# EAGLE design tdo_frontend (EAGLE 9.6.2)
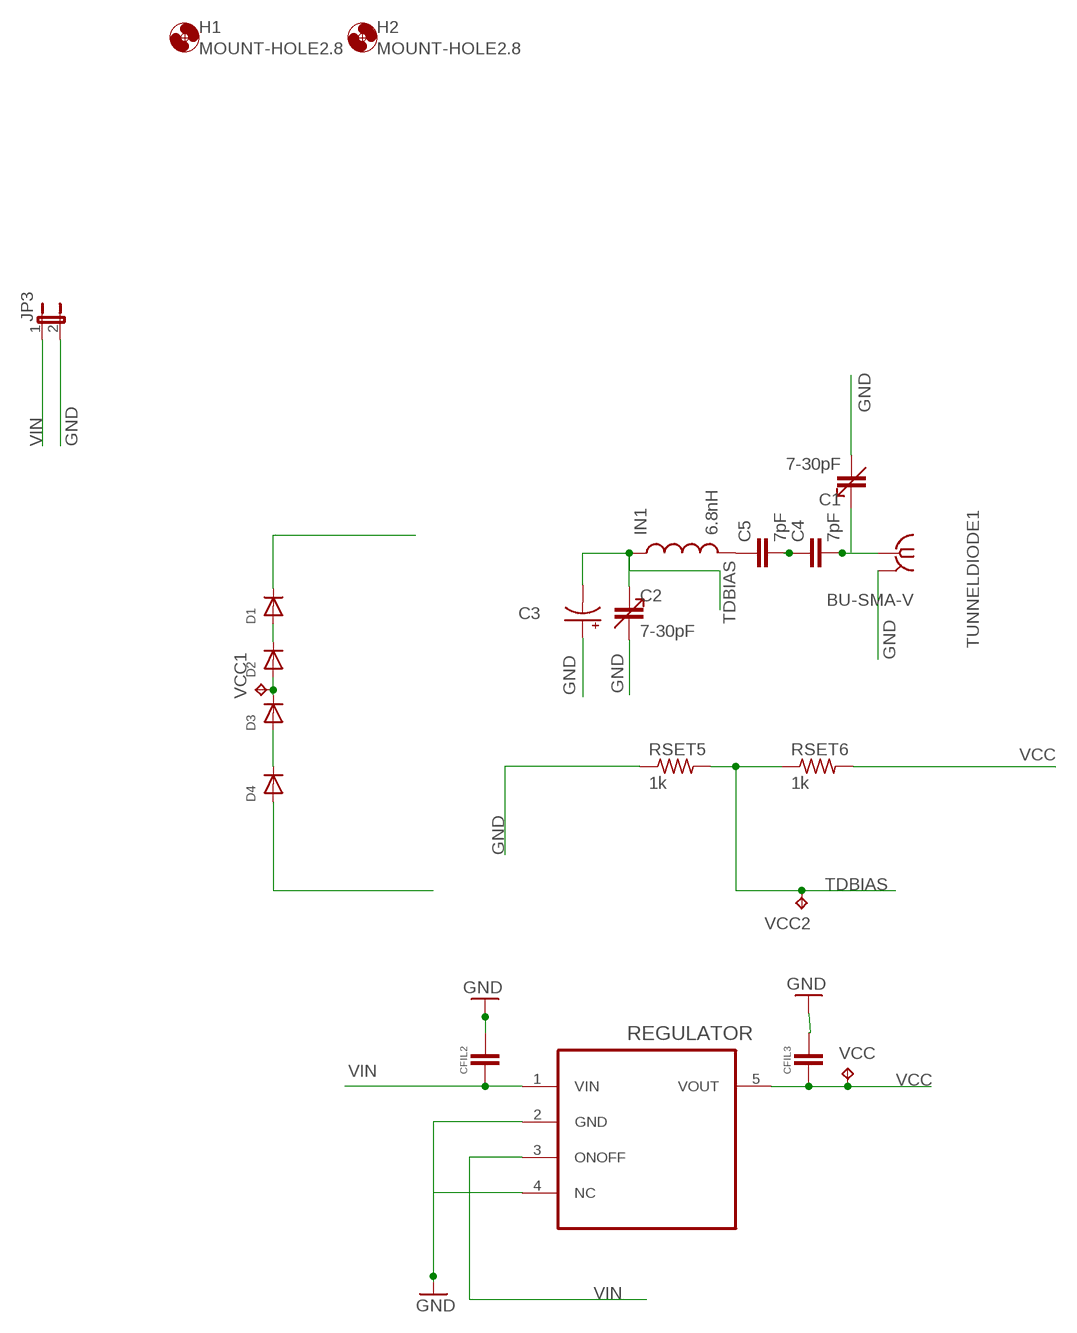
[diagram p0: schematic, sheet 1]

## Parts
C1  7-30pF  CAP_ADJSMD  [CTZ3]
C2  7-30pF  CAP_ADJSMD  [CTZ3]
C3  .22F-SUPERCAP  [DSK-RADIAL-4.8MM]
C4  7pF  CAPACITOR  [C0603]
C5  7pF  CAPACITOR  [C0603]
CFIL2  0805_1  [0805_1PRIMARY]
CFIL3  0805_1  [0805_1PRIMARY]
D1  DIODEDO-1N4148  [DO-1N4148]
D2  DIODEDO-1N4148  [DO-1N4148]
D3  DIODEDO-1N4148  [DO-1N4148]
D4  DIODEDO-1N4148  [DO-1N4148]
H1  MOUNT-HOLE2.8  [2,8]
H2  MOUNT-HOLE2.8  [2,8]
IN1  6.8nH  0603_1  [0603_1PRIMARY]
JP3  JP1E  [JP1]
REGULATOR  S-1313B20  [SOT23-5]
RSET5  1k  R-US_R0603  [R0603]
RSET6  1k  R-US_R0603  [R0603]
TUNNELDIODE1  BU-SMA-V  [BU-SMA-V]
VCC  TPPAD1-17  [P1-17]
VCC1  TPPAD1-17  [P1-17]
VCC2  TPPAD1-17  [P1-17]

## Nets
ANT2: C1.+ C4.2 TUNNELDIODE1.1
GND: C1.- C2.- C3.+ CFIL2.2 CFIL3.2 JP3.2 REGULATOR.2(GND) REGULATOR.4(NC) RSET5.1 TUNNELDIODE1.2 TUNNELDIODE1.3 TUNNELDIODE1.4 TUNNELDIODE1.5
N$1: D3.A D4.C
N$2: C4.1 C5.2
N$3: D2.A D3.C VCC1.TP
N$4: C5.1 IN1.2
N$5: D1.A D2.C
N$6: D1.C
N$7: D4.A
TDBIAS: C2.+ C3.- IN1.1 RSET5.2 RSET6.1 VCC2.TP
VCC: CFIL3.1 REGULATOR.5(VOUT) RSET6.2 VCC.TP
VIN: CFIL2.1 JP3.1 REGULATOR.1(VIN) REGULATOR.3(ONOFF)

## Library data of the parts
C1 C2 = SparkFun-Capacitors:CAP_ADJ: Variable, non-polarized capacitor
C3 = SparkFun-Capacitors:.22F-SUPERCAP: ELNA DSK-621 - 220mF Electric Double Layer Capacitor (EDLC/SuperCapacitor) A 220 mF SuperCapacitor. Used for backup power on devices with low standby current; PROD_ID: CAP-13907
C4 C5 = Moo1.2:CAPACITOR
CFIL2 CFIL3 = Moo1.2:0805_1
D1-D4 = adafruit:DIODE: Diode SMADIODE - SMA Surface Mount Package 20V 1A Schottky Diode Digikey: 641-1014-6-ND DO-1N4148 - Through Hole Small Current Diode SOD-123 20V 1 A (.5mV Vf) Schottky Diode - Digikey: MBRX120TPMSCT-ND SOD-323 10V 570mA (.38mV Vf, 3ns) Schottky Diode - Digikey: ZLLS410CT-ND SOD-523 30V 30mA Schottky Diode (RB751S-40TE61) - Digikey: RB751S-40TE61CT-ND SOT23-R/W - SOT23 Package (R = Solder Paste/Reflow Ovens, W = Hand-Soldering) BAT54Film 40V 300mA - Digikey: 497-7162-1-ND
H1 H2 = holes:MOUNT-HOLE: MOUNTING HOLE with drill center marker
IN1 = Moo1.2:0603_1
JP3 = jumper:JP1E: JUMPER
REGULATOR = customcomponents:S-1313B20
RSET5 RSET6 = rcl:R-US_: RESISTOR, American symbol
TUNNELDIODE1 = con-coax:BU-SMA-V: FEMALE SMA CONNECTOR Radiall distributor RS 112-3794; OC_FARNELL: unknown; OC_NEWARK: unknown
VCC VCC1 VCC2 = testpad:TP: Test pad

## Board
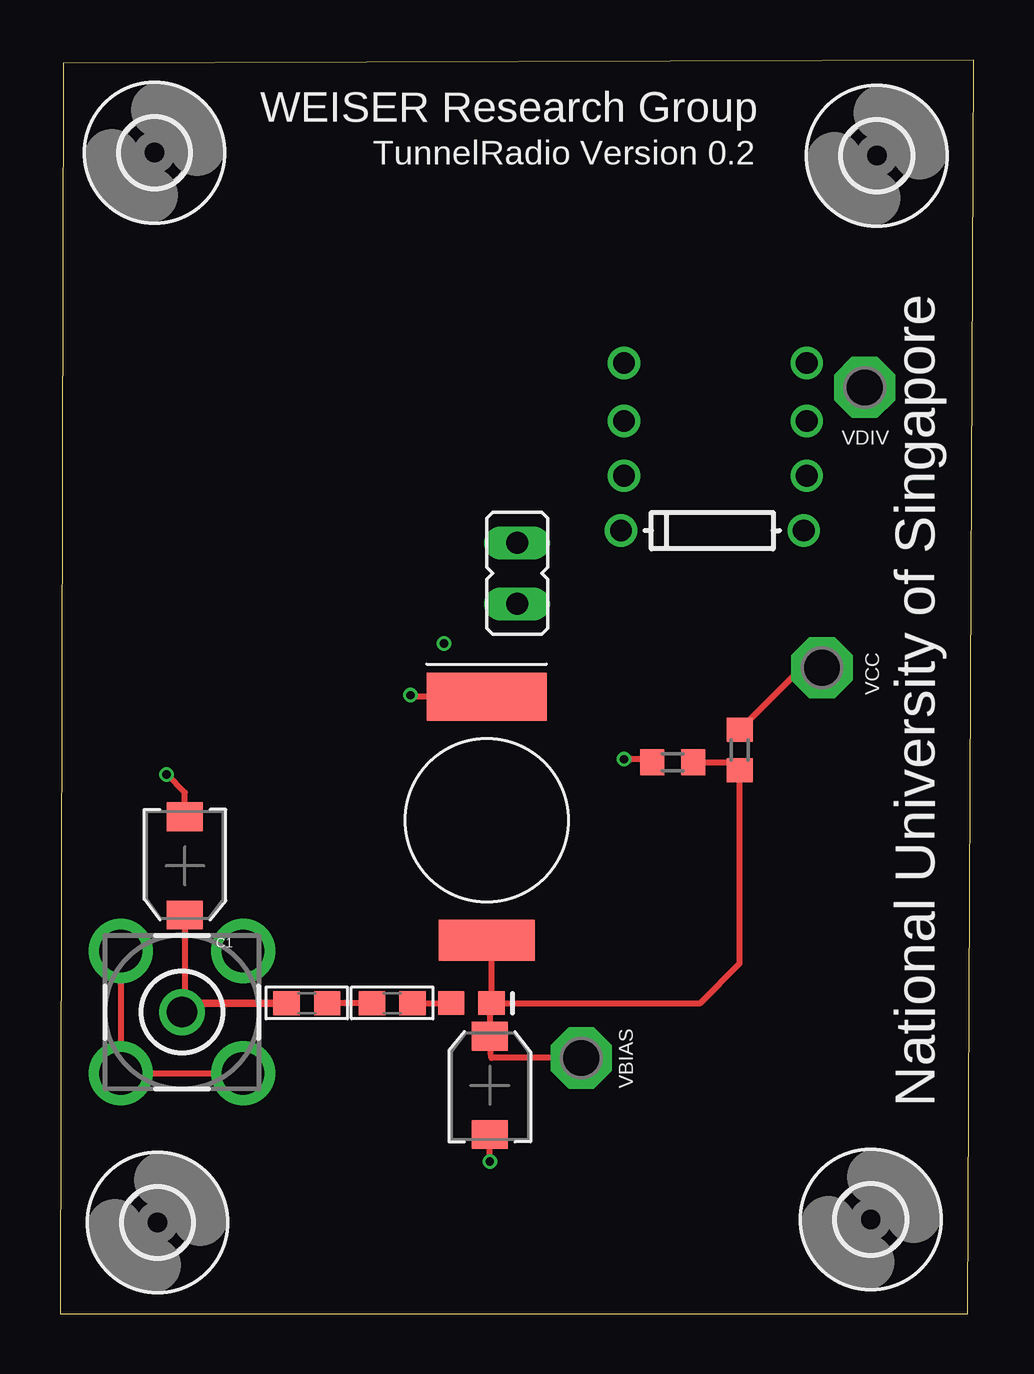
[diagram p1: board, top side]
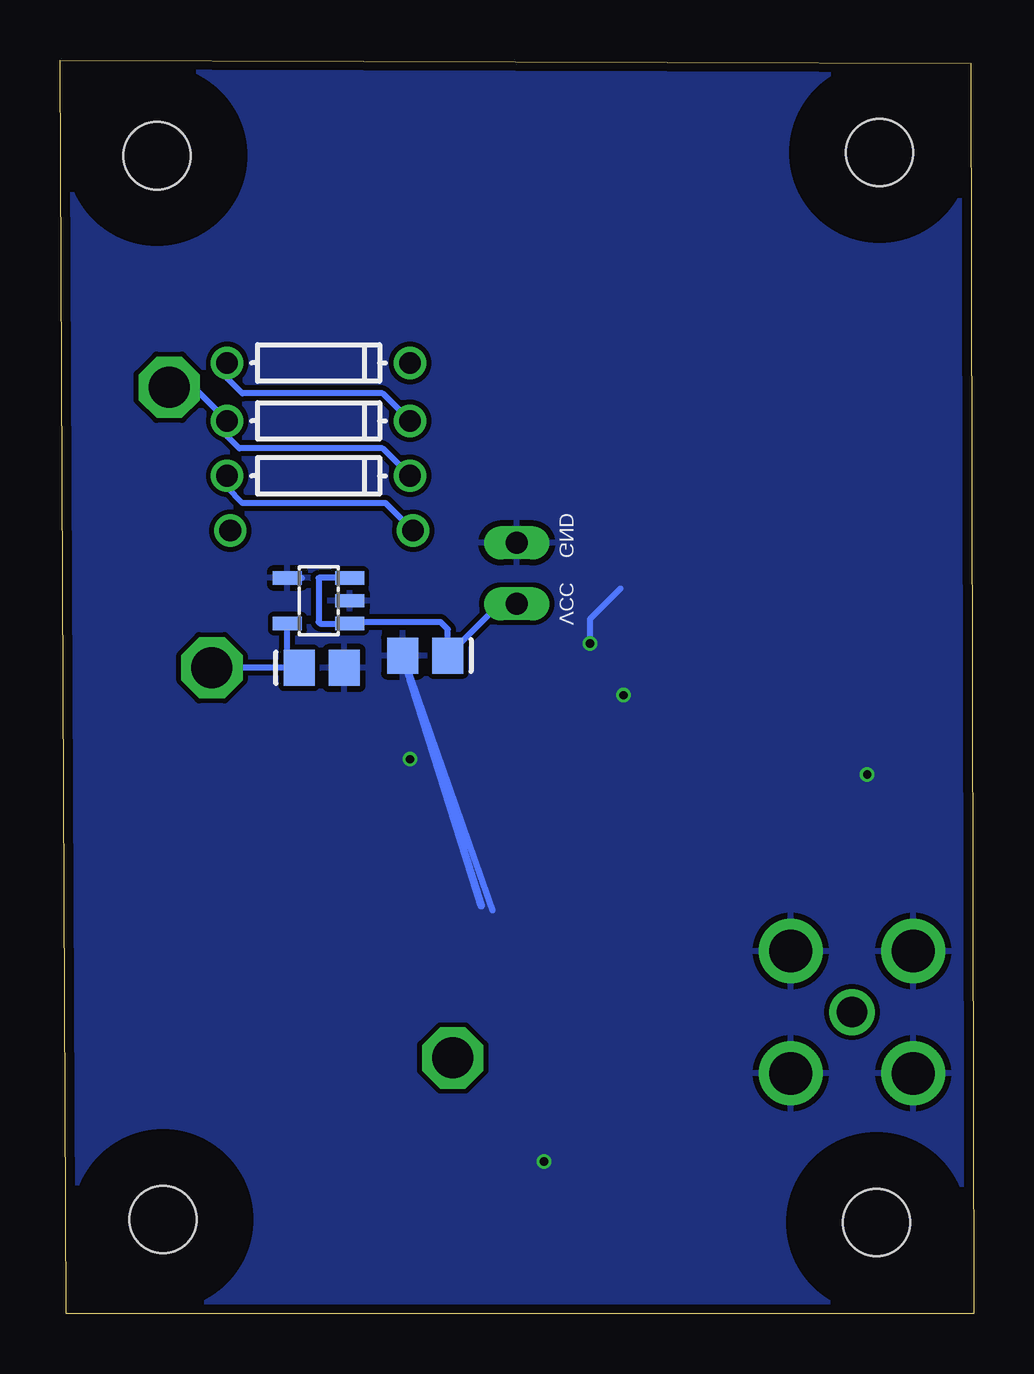
[diagram p2: board, bottom side, seen from below]

Size 38.08 x 52.25 mm. Coordinates in mm from the lower left corner, seen from the top.
Outline: 0,0 37.83,0 38.08,52.25 0.13,52.12 0,0
Copper layers (1*16): Top 0.035559375mm / dielectric 1.6mm / Bottom 0.035559375mm
Design rules "oshpark-2layer": minimum track width 6mil, minimum drill 10mil, track to track 6mil, track to pad 6mil, pad to pad 6mil, via to via 6mil, smd to smd 6mil, copper to edge 15mil, drill to drill 6mil, minimum pad ring 5mil, minimum via ring 5mil, stop-mask expansion 2.5mil, vias tented up to drill 0mil, thermal gap 10mil

### Footprints (pad centres in the part's own frame; a part is rotated, then mirrored left to right if it is on the bottom)
CTZ3 = smd 1.5 x 1.2: + 0,2.05; - 0,-2.05
DSK-RADIAL-4.8MM = smd 5 x 2: + 0,5.15 | smd 4 x 1.7: - 0,-5
C0603 = smd 1.1 x 1: 1 -0.85,0; 2 0.85,0
0805_1PRIMARY = smd 1.295 x 1.499: 1 -0.94,0; 2 0.94,0
DO-1N4148 = drill 0.9: A -3.81,0; C 3.81,0
2,8 = hole 2.8: 0,0
0603_1PRIMARY = smd 1.092 x 0.991: 1 -0.838,0; 2 0.838,0
JP1 = drill 0.914 long: 1 0,-1.27; 2 0,1.27
SOT23-5 = smd 0.55 x 1.2: 1 -0.95,-1.3; 2 0,-1.3; 3 0.95,-1.3; 4 0.95,1.3; 5 -0.95,1.3
R0603 = smd 1 x 1.1: 1 -0.85,0; 2 0.85,0
BU-SMA-V = drill 1.27: 1 0,0 | drill 1.778: 2 -2.55,2.55; 3 2.55,2.55; 4 2.55,-2.55; 5 -2.55,-2.55
P1-17 = drill 1.702 pad 2.54 octagon: TP 0,0

### Placement (x,y rotation side)
C1  5.21,18.67 180 top
C2  17.91,9.53 0 top
C3  17.78,20.57 0 top
C4  10.29,12.95 180 top
C5  13.84,12.95 180 top
CFIL2  22.86,27.43 180 bottom
CFIL3  27.18,26.92 0 bottom
D1  27.3,39.62 0 bottom
D2  27.3,37.21 0 bottom
D3  27.3,34.92 0 bottom
D4  27.18,32.64 180 top
H1  4.06,3.81 0 top
H2  34.04,48.26 0 top
H3  MOUNT-HOLE2.8  [2,8]  33.78,3.94 0 top
H4  MOUNT-HOLE2.8  [2,8]  3.94,48.39 0 top
IN1  17.14,12.95 180 top
JP3  19.05,30.86 0 top
REGULATOR  27.3,29.72 90 bottom
RSET5  25.53,22.99 0 top
RSET6  28.32,23.5 90 top
TUNNELDIODE1  5.08,12.57 0 top
VCC  31.75,26.92 0 top
VCC1  33.53,38.61 90 top
VCC2  21.72,10.67 270 top

### Tracks (layer width: path | path; a pad name or v marks a point on that pad's centre or on a via)
ANT2
  Top 0.254: C1.+ 5.21,12.95 5.21,12.57
  Top 0.305: C1.+ 5.08,16.49 | C4.2 5.21,12.95 | 5.21,12.57 TUNNELDIODE1.1
GND  (via drill 0.35)
  Top 0.254: TUNNELDIODE1.5 | TUNNELDIODE1.2 TUNNELDIODE1.5 | TUNNELDIODE1.5 TUNNELDIODE1.4 | C1.- 5.21,21.72 v4.45,22.48 | v17.91,6.35 C2.- | C3.+ 14.66,25.72 v14.61,25.78 | RSET5.1 24.55,23.11 v23.5,23.11
  Bottom 0.254: CFIL2.2 20.07,16.82 | CFIL3.2 26.24,27.25 | 28,30.67 REGULATOR.4 | 14.73,30.23 16,28.96 v16,27.94
  Bottom 0.305: CFIL2.2 20.52,17.02
  pour Bottom (isolate 0.203): 0.25,51.82 37.59,51.82 37.59,0.25 0.25,0.25
N$1
  Bottom 0.254: D4.C 24.51,33.78 30.48,33.78 31.12,34.42 D3.A
N$2
  Top 0.254: 11.43,13.25 C4.1 C5.2
N$3
  Bottom 0.254: D3.C 24.64,36.07 30.61,36.07 31.12,36.58 D2.A 32.51,38.61 VCC1.TP
N$4
  Top 0.254: C5.1 IN1.2
N$5
  Bottom 0.254: 30.99,39.75 D1.A 31.12,38.99 30.48,38.35 24.64,38.35 D2.C
TDBIAS
  Top 0.254: C2.+ 18.31,11.97 | VCC2.TP 17.97,10.67 17.91,11.3 C2.+ | RSET5.2 27.98,22.99 RSET6.1 28.32,14.61 26.67,12.95 IN1.1 | IN1.1 17.91,12.88 C2.+ | IN1.1 17.98,15.37 C3.-
VCC
  Top 0.254: VCC.TP 30.9,26.92 RSET6.2
  Bottom 0.254: CFIL3.1 28.48,27.28 | CFIL3.1 28.61,27.41 REGULATOR.5 | CFIL3.1 VCC.TP
VIN
  Bottom 0.254: 25.47,28.77 REGULATOR.1 | REGULATOR.3 27.3,30.67 27.3,28.83 27.24,28.77 REGULATOR.1 | REGULATOR.1 25.94,28.83 22.23,28.83 21.92,28.52 CFIL2.1 19.76,29.59 JP3.1

### Text on the board
tNames: WEISER Research Group | TunnelRadio Version 0.2 | VDIV | VBIAS | National University of Singapore
bNames: GND | VCC